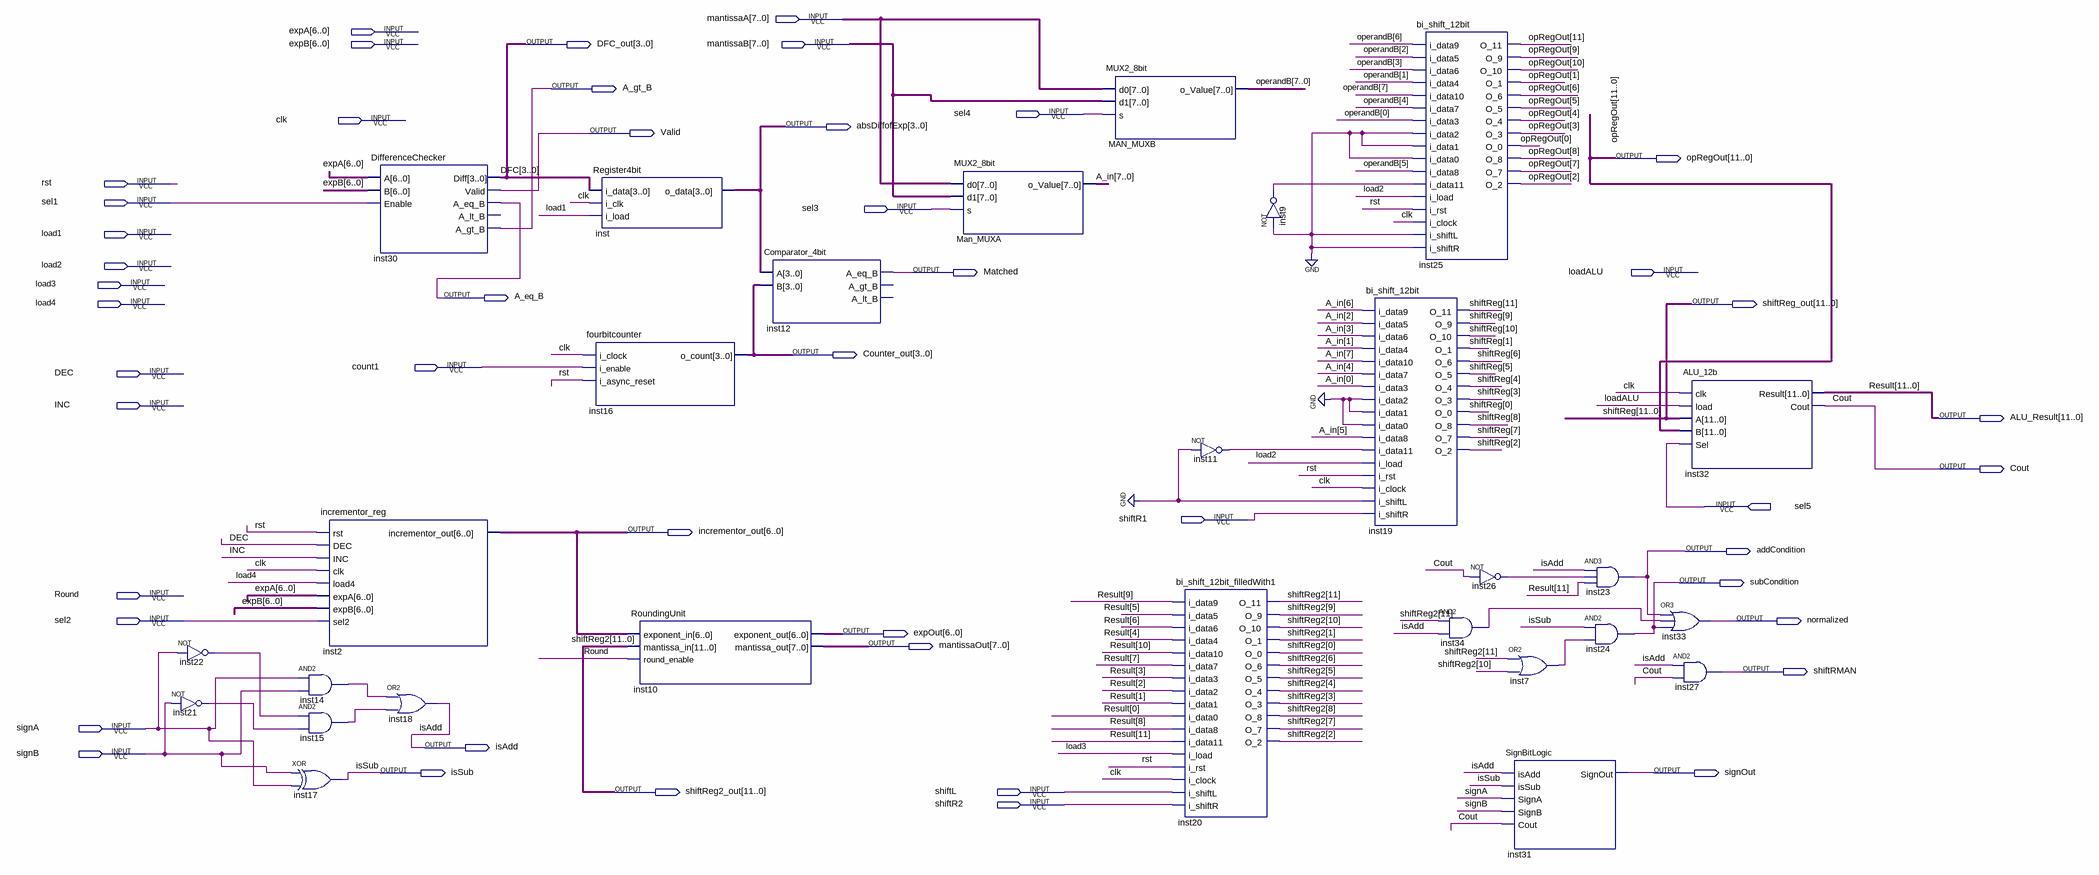
[diagram p0: schematic sheet]
// Quartus schematic DATAPATH.bdf as structural Verilog: 28 symbols, 47 pins
module DATAPATH (
  input  [7:0] mantissaA,
  input  [6:0] expA,
  input  [6:0] expB,
  input  [7:0] mantissaB,
  input  sel4,
  input  clk,
  input  rst,
  input  sel1,
  input  sel3,
  input  load1,
  input  load2,
  input  loadALU,
  input  load3,
  input  load4,
  input  count1,
  input  DEC,
  input  INC,
  input  sel5,
  input  shiftR1,
  input  Round,
  input  sel2,
  input  signA,
  input  signB,
  input  shiftL,
  input  shiftR2,
  output [3:0] DFC_out,
  output A_gt_B,
  output [3:0] absDiffofExp,
  output Valid,
  output [11:0] opRegOut,
  output Matched,
  output A_eq_B,
  output [11:0] shiftReg_out,
  output [3:0] Counter_out,
  output [11:0] ALU_Result,
  output Cout,
  output [6:0] incrementor_out,
  output addCondition,
  output subCondition,
  output normalized,
  output [6:0] expOut,
  output [7:0] mantissaOut,
  output shiftRMAN,
  output isAdd,
  output isSub,
  output signOut,
  output [11:0] shiftReg2_out
);

  wire inst7_out, inst9_out, inst11_out, inst14_out, inst15_out, inst21_out, inst22_out, inst26_out,
       inst34_out;
  wire [7:0] A_in, operandB;

  not inst22 (inst22_out, signA);
  not inst21 (inst21_out, signB);
  incrementor_reg inst2 (
    .rst(rst), .DEC(DEC), .INC(INC), .clk(clk), .load4(load4), .expA(expA), .expB(expB), .sel2(sel2),
    .incrementor_out(incrementor_out));
  and inst14 (inst14_out, signA, signB);
  and inst15 (inst15_out, inst22_out, inst21_out);
  xor inst17 (isSub, signB, signA);
  DifferenceChecker inst30 (
    .A(expA), .B(expB), .Enable(sel1), .Diff(DFC_out), .Valid(Valid), .A_eq_B(A_eq_B), .A_gt_B(A_gt_B));  // open: A_lt_B
  or inst18 (isAdd, inst14_out, inst15_out);
  Register4bit inst (.i_data(DFC_out), .i_clk(clk), .i_load(load1), .o_data(absDiffofExp));
  fourbitcounter inst16 (.i_clock(clk), .i_enable(count1), .i_async_reset(rst), .o_count(Counter_out));
  RoundingUnit inst10 (
    .exponent_in(incrementor_out), .mantissa_in(shiftReg2_out), .round_enable(Round), .exponent_out(expOut),
    .mantissa_out(mantissaOut));
  Comparator_4bit inst12 (.A(absDiffofExp), .B(Counter_out), .A_eq_B(Matched));  // open: A_gt_B, A_lt_B
  MUX2_8bit Man_MUXA (.d0(mantissaA), .d1(mantissaB), .s(sel3), .o_Value(A_in));
  MUX2_8bit MAN_MUXB (.d0(mantissaA), .d1(mantissaB), .s(sel4), .o_Value(operandB));
  not inst11 (inst11_out, 1'b0);
  bi_shift_12bit_filledWith1 inst20 (
    .i_data9(ALU_Result[9]), .i_data5(ALU_Result[5]), .i_data6(ALU_Result[6]), .i_data4(ALU_Result[4]),
    .i_data10(ALU_Result[10]), .i_data7(ALU_Result[7]), .i_data3(ALU_Result[3]), .i_data2(ALU_Result[2]),
    .i_data1(ALU_Result[1]), .i_data0(ALU_Result[0]), .i_data8(ALU_Result[8]), .i_data11(ALU_Result[11]),
    .i_load(load3), .i_rst(rst), .i_clock(clk), .i_shiftL(shiftL), .i_shiftR(shiftR2),
    .O_11(shiftReg2_out[11]), .O_9(shiftReg2_out[9]), .O_10(shiftReg2_out[10]), .O_1(shiftReg2_out[1]),
    .O_0(shiftReg2_out[0]), .O_6(shiftReg2_out[6]), .O_5(shiftReg2_out[5]), .O_4(shiftReg2_out[4]),
    .O_3(shiftReg2_out[3]), .O_8(shiftReg2_out[8]), .O_7(shiftReg2_out[7]), .O_2(shiftReg2_out[2]));
  not inst9 (inst9_out, 1'b0);
  bi_shift_12bit inst19 (
    .i_data9(A_in[6]), .i_data5(A_in[2]), .i_data6(A_in[3]), .i_data4(A_in[1]), .i_data10(A_in[7]),
    .i_data7(A_in[4]), .i_data3(A_in[0]), .i_data2(1'b0), .i_data1(1'b0), .i_data0(1'b0), .i_data8(A_in[5]),
    .i_data11(inst11_out), .i_load(load2), .i_rst(rst), .i_clock(clk), .i_shiftL(1'b0), .i_shiftR(shiftR1),
    .O_11(shiftReg_out[11]), .O_9(shiftReg_out[9]), .O_10(shiftReg_out[10]), .O_1(shiftReg_out[1]),
    .O_6(shiftReg_out[6]), .O_5(shiftReg_out[5]), .O_4(shiftReg_out[4]), .O_3(shiftReg_out[3]),
    .O_0(shiftReg_out[0]), .O_8(shiftReg_out[8]), .O_7(shiftReg_out[7]), .O_2(shiftReg_out[2]));
  bi_shift_12bit inst25 (
    .i_data9(operandB[6]), .i_data5(operandB[2]), .i_data6(operandB[3]), .i_data4(operandB[1]),
    .i_data10(operandB[7]), .i_data7(operandB[4]), .i_data3(operandB[0]), .i_data2(1'b0), .i_data1(1'b0),
    .i_data0(1'b0), .i_data8(operandB[5]), .i_data11(inst9_out), .i_load(load2), .i_rst(rst), .i_clock(clk),
    .i_shiftL(1'b0), .i_shiftR(1'b0), .O_11(opRegOut[11]), .O_9(opRegOut[9]), .O_10(opRegOut[10]),
    .O_1(opRegOut[1]), .O_6(opRegOut[6]), .O_5(opRegOut[5]), .O_4(opRegOut[4]), .O_3(opRegOut[3]),
    .O_0(opRegOut[0]), .O_8(opRegOut[8]), .O_7(opRegOut[7]), .O_2(opRegOut[2]));
  and inst34 (inst34_out, shiftReg2_out[11], isAdd);
  not inst26 (inst26_out, Cout);
  SignBitLogic inst31 (.isAdd(isAdd), .isSub(isSub), .SignA(signA), .SignB(signB), .Cout(Cout), .SignOut(signOut));
  or inst7 (inst7_out, shiftReg2_out[11], shiftReg2_out[10]);
  and inst23 (addCondition, isAdd, inst26_out, ALU_Result[11]);
  and inst24 (subCondition, isSub, inst7_out);
  ALU_12b inst32 (
    .clk(clk), .load(loadALU), .A(shiftReg_out), .B(opRegOut), .Sel(sel5), .Result(ALU_Result), .Cout(Cout));
  or inst33 (normalized, addCondition, inst34_out, subCondition);
  and inst27 (shiftRMAN, isAdd, Cout);

  // Other names for the same wires on the sheet: Result[11:0] = ALU_Result; DFC[3:0] = DFC_out;
  //   shiftReg[11:0] = shiftReg_out; shiftReg2[11:0] = shiftReg2_out
endmodule
